# EAGLE design Rs232Iso-v1.2 (EAGLE 6.4)
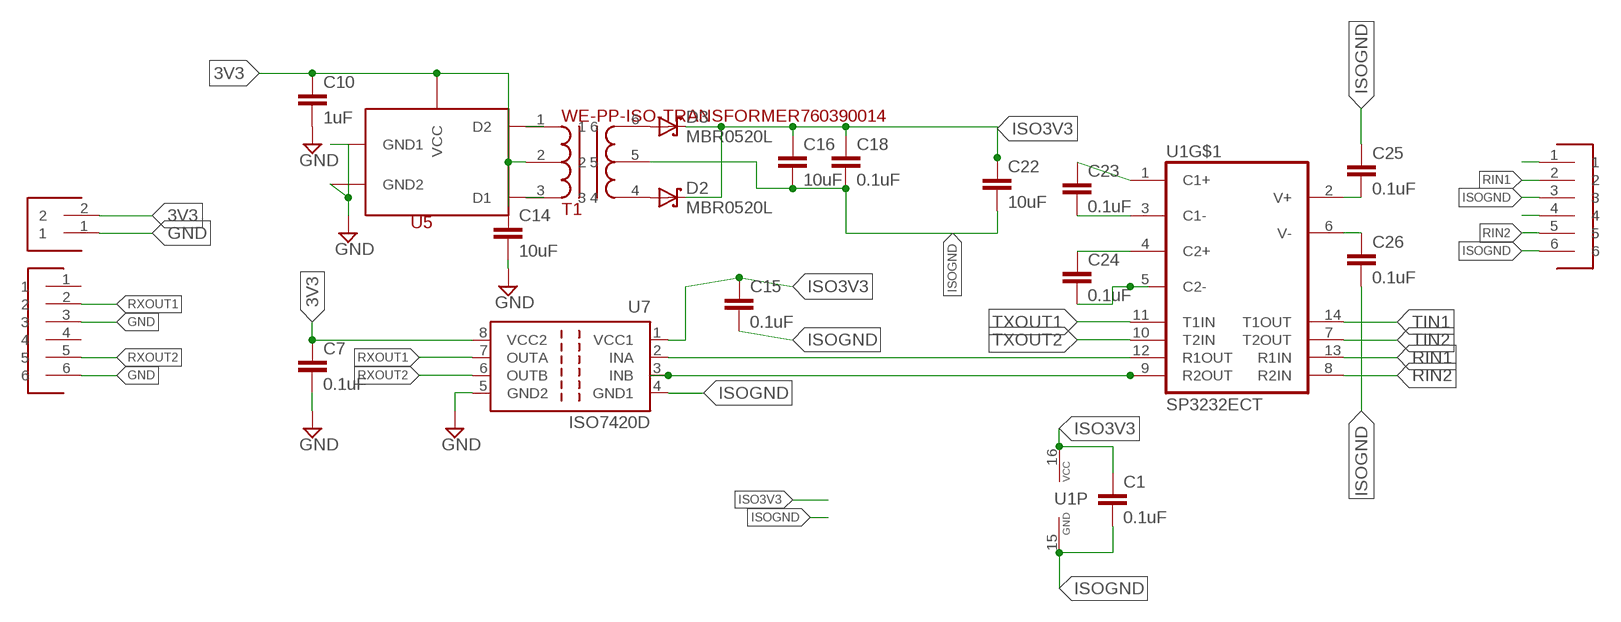
[diagram p0: schematic, sheet 1]

## Parts
C1  0.1uF  CAP0603  [0603]
C7  0.1uF  CAP0603  [0603]
C10  1uF  CAP0805  [0805]
C14  10uF  CAP0805  [0805]
C15  0.1uF  CAP0603  [0603]
C16  10uF  CAP0805  [0805]
C18  0.1uF  CAP0603  [0603]
C22  10uF  CAP0805  [0805]
C23  0.1uF  CAP0603  [0603]
C24  0.1uF  CAP0603  [0603]
C25  0.1uF  CAP0603  [0603]
C26  0.1uF  CAP0603  [0603]
D2  MBR0520L  [SOD123]
D3  MBR0520L  [SOD123]
J1  CON-2STD-2.54  [CON-2]
J2  CON-6  [CON-6]
J4  CON-6  [CON-6]
T1  WE-PP-ISO-TRANSFORMER760390014  [WE_TRANSFORMER]
U1  SP3232ECT  [SO16]
U5  SN6501DBVT  [SOT23-5L]
U7  ISO7420D  [SO08]

## Nets
3V3: C7.1 C10.1 C14.1 J1.2 T1.2 U5.2(VCC) U7.8(VCC2)
GND: C7.2 C10.2 C14.2 J1.1 J4.3 J4.6 U5.4(GND1) U5.5(GND2) U7.5(GND2)
ISO3V3: C1.1 C15.1 C16.1 C18.1 C22.1 D2.C D3.C U1.16(P:VCC) U7.1(VCC1)
ISOGND: C1.2 C15.2 C16.2 C18.2 C22.2 C25.1 C26.2 J2.3 J2.6 T1.5 U1.15(P:GND) U7.4(GND1)
N$1: D3.A T1.6
N$2: D2.A T1.4
N$3: J2.1
N$4: T1.1 U5.3(D2)
N$5: T1.3 U5.1(D1)
N$8: J2.4
N$10: C23.2 U1.3(C1-)
N$12: U1.12(R1OUT) U7.2(INA)
N$14: C24.1 U1.4(C2+)
N$15: U1.9(R2OUT) U7.3(INB)
N$18: C24.2 U1.5(C2-)
N$19: C23.1 U1.1(C1+)
RIN1: J2.2 U1.13(R1IN)
RIN2: J2.5 U1.8(R2IN)
RXOUT1: J4.2 U7.7(OUTA)
RXOUT2: J4.5 U7.6(OUTB)
TIN1: U1.14(T1OUT)
TIN2: U1.7(T2OUT)
TXOUT1: U1.11(T1IN)
TXOUT2: U1.10(T2IN)
V+: C25.2 U1.2(V+)
V-: C26.1 U1.6(V-)
Unconnected: J4.1 J4.4

## Library data of the parts
C1 C7 C10 C14-C16 C18 C22-C26 = __bo_caps:CAP
D2 D3 = __my:MBR0520L
J1 = __my:CON-2
J2 J4 = __my:CON-6
T1 = __my:WE-PP-ISO-TRANSFORMER
U1 = __my:SP3232
U5 = __my:SN6501DBVT
U7 = __my:ISO7420

## Board
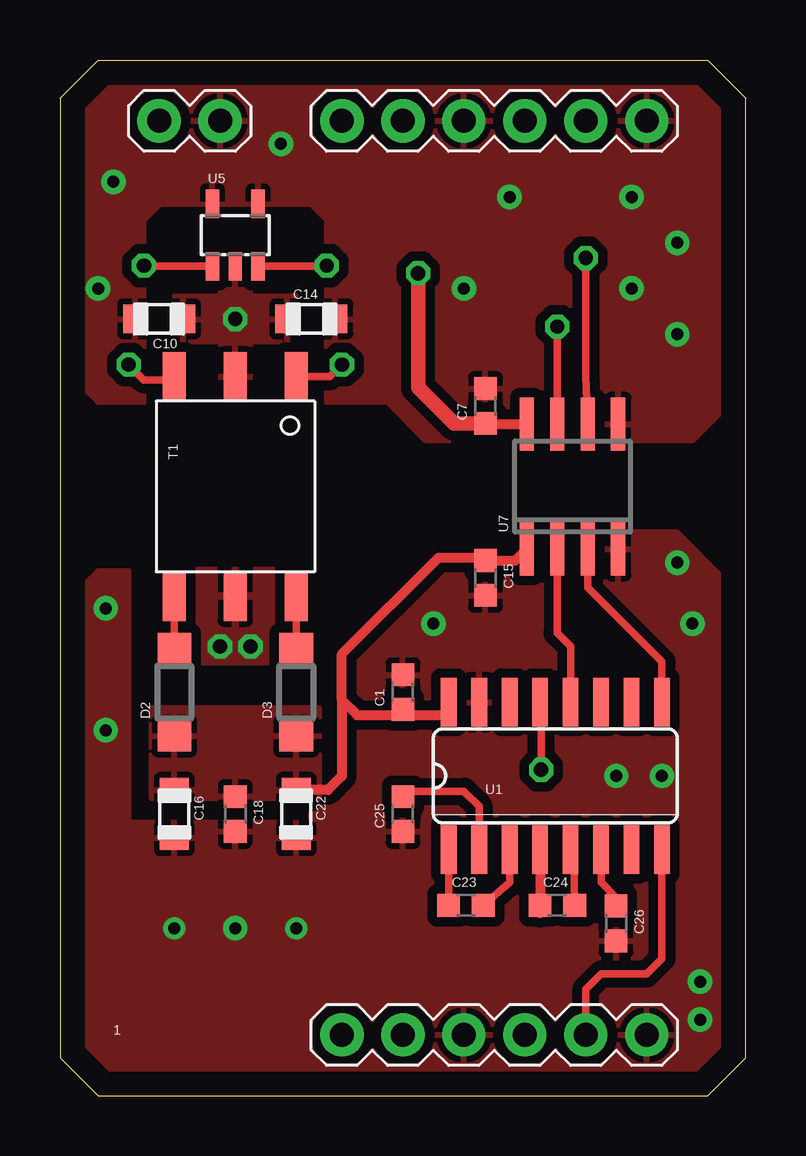
[diagram p1: board, top side]
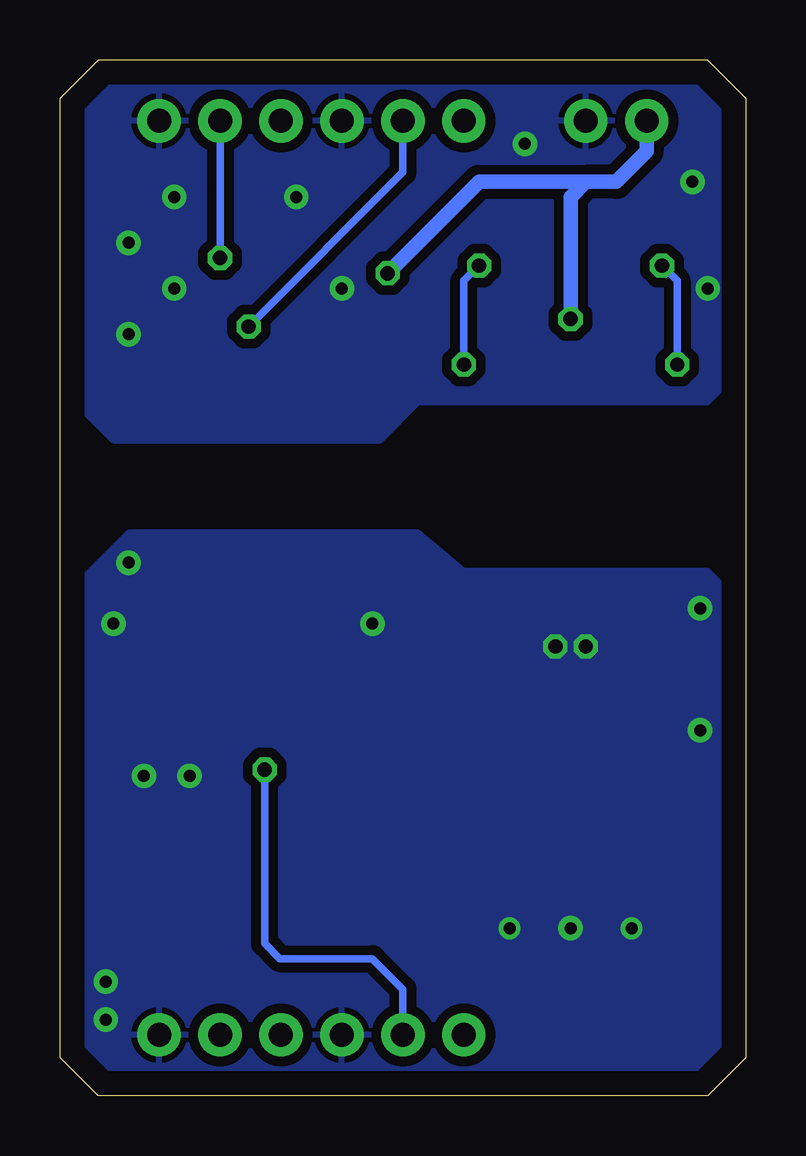
[diagram p2: board, bottom side, seen from below]

Size 28.57 x 43.18 mm. Coordinates in mm from the lower left corner, seen from the top.
Outline: 28.57,1.59 28.57,41.59 26.99,43.18 1.59,43.18 0,41.59 0,1.59 1.59,0 26.99,0 28.57,1.59
Copper layers (1*16): Top 0.035mm / dielectric 1.5mm / Bottom 0.035mm
Design rules "default *": minimum track width 10mil, minimum drill 22mil, track to track 8mil, track to pad 8mil, pad to pad 8mil, via to via 8mil, smd to smd 8mil, copper to edge 40mil, drill to drill 8mil, minimum pad ring 10mil, minimum via ring 8mil, stop-mask expansion 4mil, vias tented up to drill 20mil, thermal gap 10mil

### Footprints (pad centres in the part's own frame; a part is rotated, then mirrored left to right if it is on the bottom)
0603 = smd 0.95 x 0.95: 1 -0.725,0; 2 0.725,0
0805 = smd 1 x 1.2: 1 -1,0; 2 1,0
SOD123 = smd 1.27 x 1.4: A 1.829,0; C -1.829,0
CON-2 = drill 1 pad 1.8: 1 0,1.27; 2 0,-1.27
CON-6 = drill 1 pad 1.8: 1 0,6.35; 2 0,3.81; 3 0,1.27; 4 0,-1.27; 5 0,-3.81; 6 0,-6.35
WE_TRANSFORMER = smd 2.057 x 0.965: 1 -4.572,2.54; 2 -4.572,0; 3 -4.572,-2.54; 4 4.572,-2.54; 5 4.572,0; 6 4.572,2.54
SO16 = smd 0.66 x 2.032: 1 -4.445,-3.073; 2 -3.175,-3.073; 3 -1.905,-3.073; 4 -0.635,-3.073; 5 0.635,-3.073; 6 1.905,-3.073; 7 3.175,-3.073; 8 4.445,-3.073; 9 4.445,3.073; 10 3.175,3.073; 11 1.905,3.073; 12 0.635,3.073; 13 -0.635,3.073; 14 -1.905,3.073; 15 -3.175,3.073; 16 -4.445,3.073
SOT23-5L = smd 0.55 x 1.2: 1 -0.95,-1.3; 2 0,-1.3; 3 0.95,-1.3; 4 0.95,1.3; 5 -0.95,1.3
SO08 = smd 0.6 x 2.2: 1 -1.905,-2.6; 2 -0.635,-2.6; 3 0.635,-2.6; 4 1.905,-2.6; 5 1.905,2.6; 6 0.635,2.6; 7 -0.635,2.6; 8 -1.905,2.6

### Placement (x,y rotation side)
C1  14.29,16.83 90 top
C7  17.73,28.76 90 top
C10  4.13,32.38 180 top
C14  10.48,32.38 0 top
C15  17.73,21.59 270 top
C16  4.76,11.75 270 top
C18  7.3,11.75 270 top
C22  9.84,11.75 270 top
C23  16.92,7.94 0 top
C24  20.73,7.94 0 top
C25  14.29,11.75 90 top
C26  23.17,7.19 270 top
D2  4.76,16.83 90 top
D3  9.84,16.83 90 top
J1  5.4,40.64 270 top
J2  18.1,2.54 90 top
J4  18.1,40.64 90 top
T1  7.3,25.4 270 top
U1  20.64,13.34 0 top
U5  7.3,35.88 0 top
U7  21.35,25.4 0 top

### Tracks (layer width: path | path; a pad name or v marks a point on that pad's centre or on a via)
3V3  (via drill 0.6)
  Top 0.406: U5.2 7.3,34.92 | C7.1 17.76,28 U7.8
  Top 0.61: v14.92,34.29 14.92,29.53 16.42,28.03 C7.1
  Bottom 0.61: 6.67,38.1 7.3,37.47 v7.3,32.38 | J1.2 4.13,39.37 5.4,38.1 6.67,38.1 | v14.92,34.29 11.11,38.1 6.67,38.1
  pour Top (isolate 0.406): 4.76,33.34 4.76,31.43 6.67,31.43 6.67,29.84 7.94,29.84 7.94,31.43 9.84,31.43 9.84,33.34 7.94,33.34 7.94,34.92 6.67,34.92 6.67,33.34
GND  (via drill 0.5 pad 1.02)
  other vias: 16.83,33.66 25.72,35.56 18.73,37.47 23.81,37.47 23.81,33.66 25.72,31.75 2.22,38.1 1.59,33.66 9.21,39.69
  pour Bottom (isolate 0.406): 0.95,41.27 2.54,42.86 26.04,42.86 27.62,41.27 27.62,28.57 26.35,27.3 15.24,27.3 13.65,28.89 1.59,28.89 0.95,29.53
  pour Top (isolate 0.406): 0.95,41.27 2.54,42.86 26.04,42.86 27.62,41.27 27.62,28.57 26.35,27.3 15.24,27.3 13.65,28.89 11.11,28.89 11.11,36.51 10.48,37.15 4.13,37.15 3.49,36.51 3.49,28.89 1.59,28.89 0.95,29.53
ISO3V3
  Top 0.406: 11.75,16.51 11.75,18.41 15.77,22.44 17.6,22.44 C15.1 18.96,22.32 U7.1 | 11.75,16.51 12.38,15.88 14.02,15.88 | 14.02,15.88 16.29,15.88 U1.16 | 14.02,15.88 C1.1 | 11.75,16.51 11.75,13.34 11.16,12.75 C22.1 9.89,12.7
  pour Top (isolate 0.406): 3.81,16.19 10.79,16.19 10.79,12.38 3.81,12.38
ISOGND  (via drill 0.5, 0.5 pad 1.02, 0.6)
  other vias: 25.72,22.23 6.67,18.73 25.08,13.34 1.91,20.32 4.76,6.99 26.35,19.68 26.67,3.17 23.18,13.34 7.3,6.99 1.91,15.24 15.56,19.68 7.94,18.73 9.84,6.99 26.67,4.76
  pour Bottom (isolate 0.406): 0.95,21.27 1.59,21.91 11.75,21.91 13.65,23.5 25.72,23.5 27.62,21.59 27.62,1.91 26.35,0.64 2.22,0.64 0.95,1.91
  pour Top (isolate 0.406): 11.75,21.59 11.75,0.64 26.35,0.64 27.62,1.91 27.62,21.59 25.72,23.5 13.33,23.5
  pour Top (isolate 0.406): 0.95,21.27 1.59,21.91 2.86,21.91 2.86,11.43 10.48,11.43 10.48,21.59 11.75,21.59 11.75,0.64 2.22,0.64 0.95,1.91
  pour Top (isolate 0.406, rank 2): 2.86,21.91 10.48,21.91 10.48,18.1 2.86,18.1
N$1
  Top 0.305: T1.6 D3.A
N$2
  Top 0.305: T1.4 D2.A
N$4  (via drill 0.6)
  Top 0.305: T1.1 11.24,29.97 v11.75,30.48 | U5.3 11.08,34.58 v11.11,34.61
  Bottom 0.305: v11.75,30.48 11.75,33.97 v11.11,34.61
N$5  (via drill 0.6)
  Top 0.305: U5.1 3.52,34.58 v3.49,34.61 | v2.86,30.48 3.49,29.84 4.64,29.84 T1.3
  Bottom 0.305: v3.49,34.61 2.86,33.97 v2.86,30.48
N$10
  Top 0.305: U1.3 18.73,8.89 C23.2
N$12
  Top 0.305: U7.2 20.72,19.29 21.27,18.73 U1.12 21.27,15.88
N$14
  Top 0.406: U1.4 20,7.62 C24.1
N$15
  Top 0.305: U7.3 21.99,21.19 25.08,18.1 U1.9
N$18
  Top 0.305: U1.5 21.41,10.13 C24.2
N$19
  Top 0.305: U1.1 16.19,7.66 C23.1
RIN1  (via drill 0.6)
  Top 0.305: v20.05,13.6 20.05,16.36 U1.13
  Bottom 0.305: J2.2 14.29,4.45 15.56,5.71 19.41,5.71 20.05,6.35 v20.05,13.6
RIN2
  Top 0.305: J2.5 21.91,4.45 22.54,5.08 24.45,5.08 25.08,5.71 U1.8
RXOUT1  (via drill 0.6)
  Top 0.305: v20.72,32.07 U7.7
  Bottom 0.305: J4.2 14.29,38.5 v20.72,32.07
RXOUT2  (via drill 0.6)
  Top 0.305: v21.91,34.92 21.91,29.98 U7.6
  Bottom 0.305: J4.5 v21.91,34.92
V+
  Top 0.305: 14.33,12.7 16.83,12.7 17.46,12.06 U1.2
  Top 0.406: C25.2 14.33,12.7
V-
  Top 0.305: U1.6 22.54,8.89 23.17,8.26 C26.1

### Text on the board
tPlace: 1